# Altium schematic sheet CH573.SchDoc
size A3; SheetNumber: 3; SheetTotal: 3
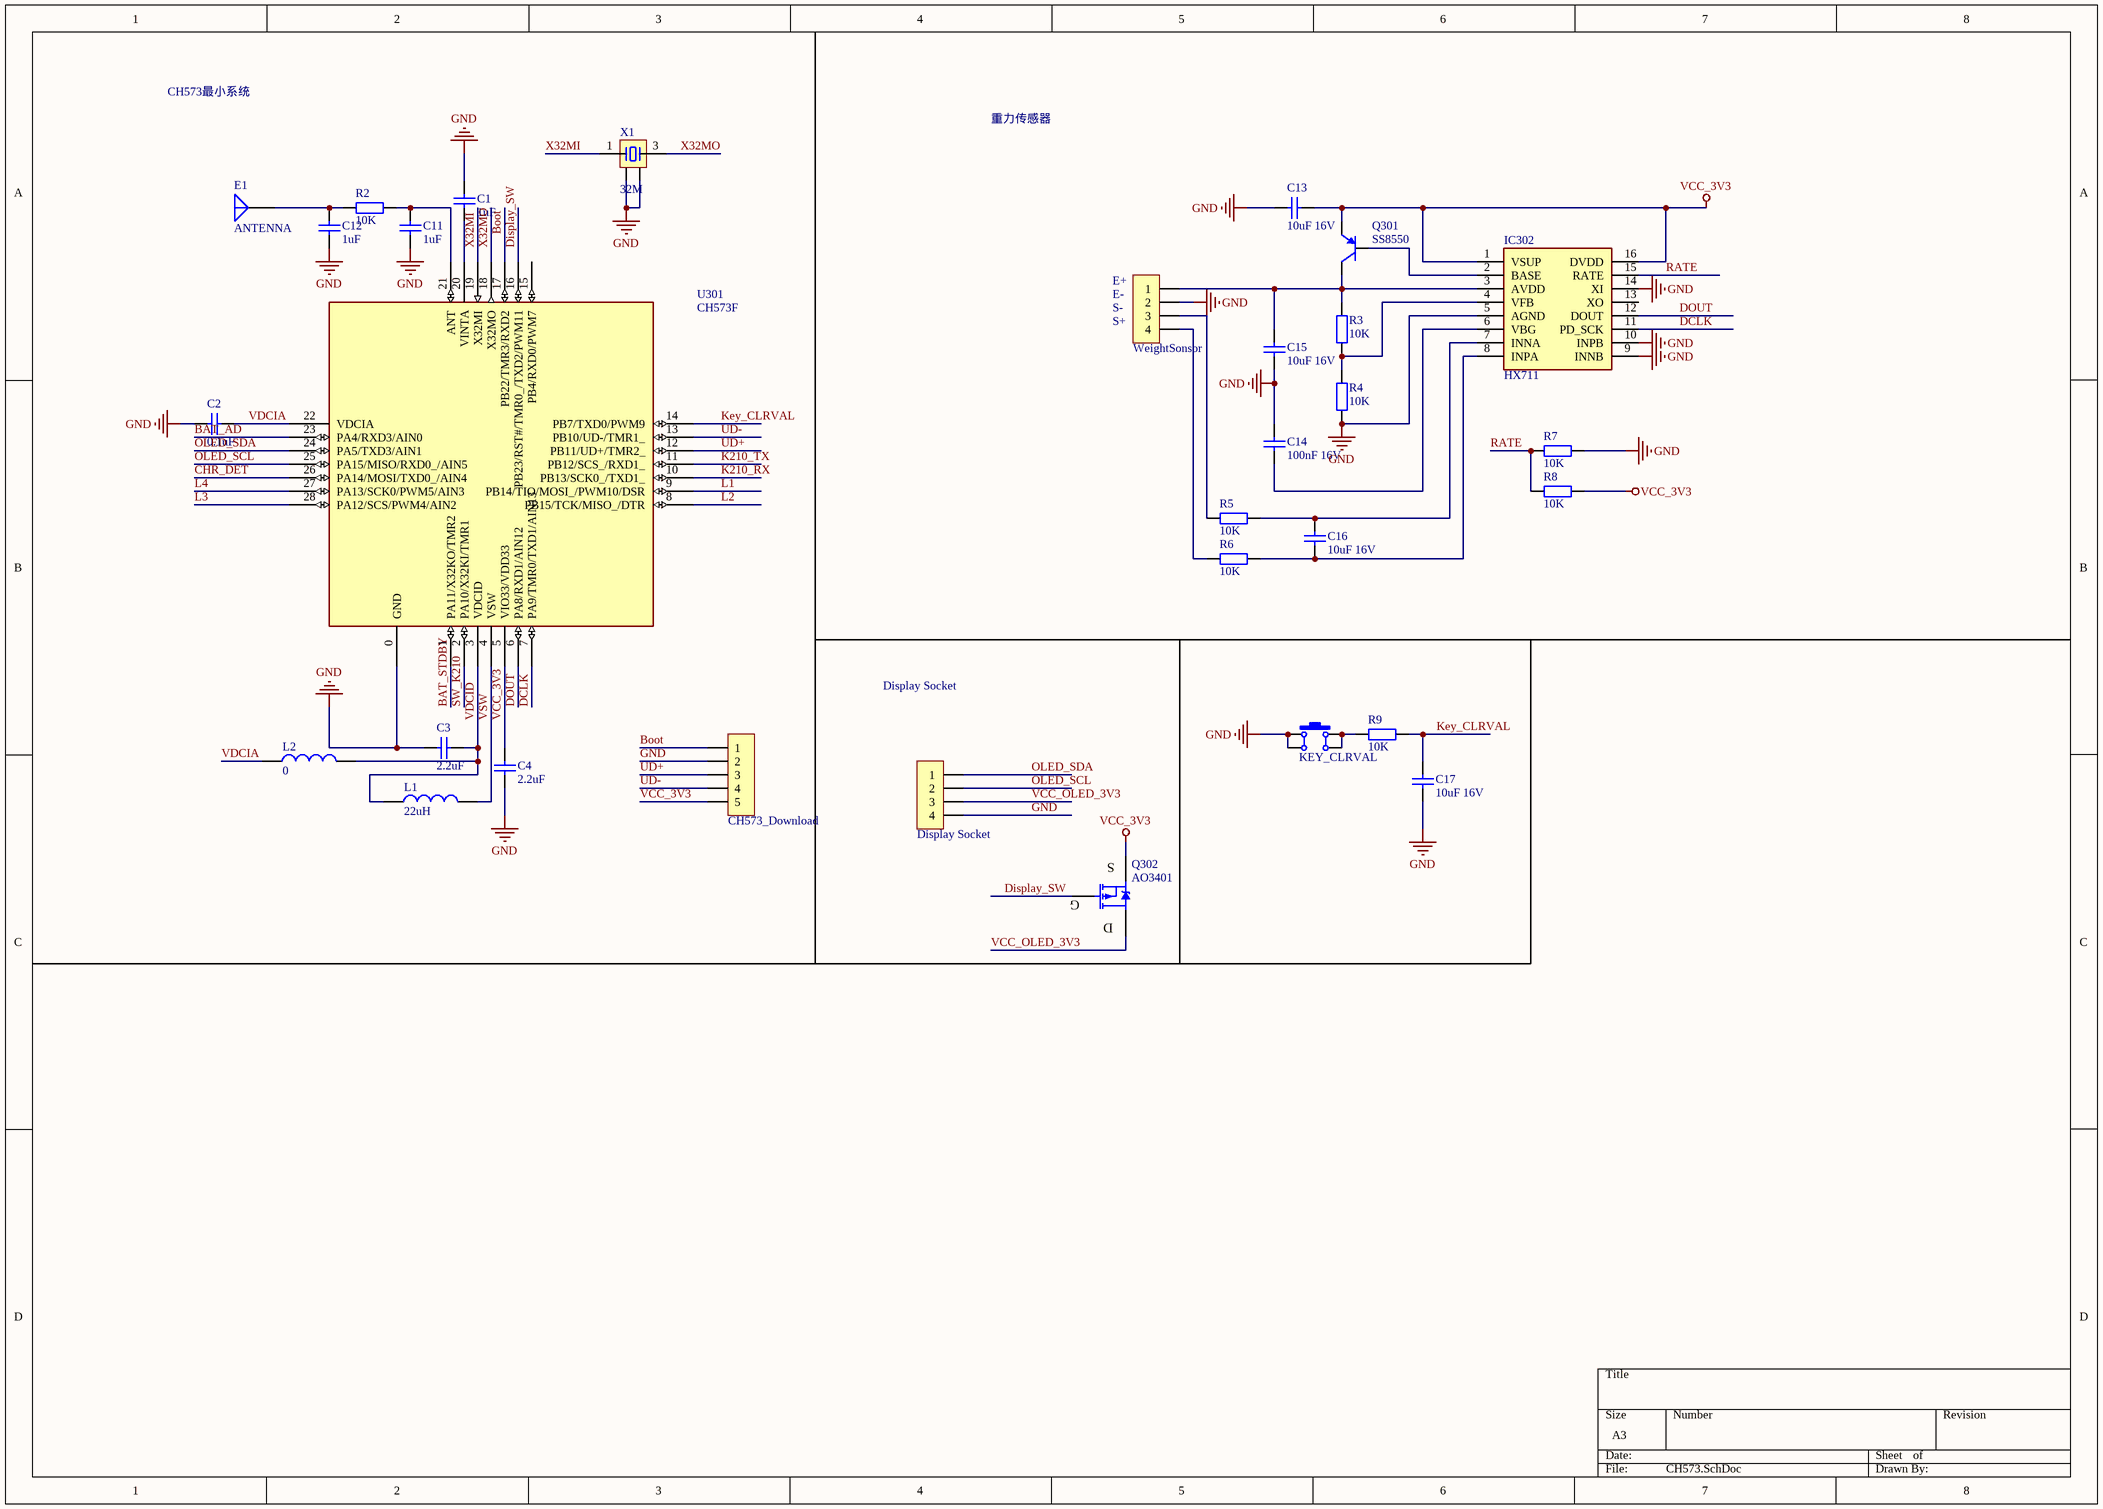
[diagram p0: CH573.SchDoc]

## Parts
C1  1uF  [C0603_L]
C2  0.1uF  [C0603_L]
C3  2.2uF  [C0603_L]
C4  2.2uF  [C0603_L]
C11  1uF  [C0201_L]
C12  1uF  [C0201_L]
C13  10uF 16V  [C0805_L]
C14  100nF 16V  [C0603_L]
C15  10uF 16V  [C0603_L]
C16  10uF 16V  [C0603_L]
C17  10uF 16V  [C0603_L]
CH573_Download  HDR-1X5  [MX1.25-L-5P]  (value not drawn)
Display_Socket  HDR-1X4  [HDR2.54-M-LI-4P]  (value not drawn)
E1  ANTENNA  [ANT-F-1-2.4G-1.6]
IC302  HX711  [SOIC127P600X160-16N]
KEY_CLRVAL  4x4x1.5  [SW SMD-4*4*1.5]  (value not drawn)
L1  22uH  [L0603]
L2  0  [L0603]
Q301  SS8550  [SOT23-3N]
Q302  AO3401  [SOT23-3N]
R2  10K  [R0201_L]
R3  10K  [R0603_L]
R4  10K  [R0603_L]
R5  10K  [R0603_L]
R6  10K  [R0603_L]
R7  10K  [R0603_L]
R8  10K  [R0603_L]
R9  10K  [R0603_L]
U301  CH573F  [QFN28_4X4]
WeightSonsor  HDR-1X4  [XH2.54-LI-4P]  (value not drawn)
X1  32M  [XTAL-3225-4P]

## Nets
GND: C1.2 C2.2 C3.2 C4.2 C11.2 C12.2 C13.1 C14.2 C15.1 C17.1 CH573_Download.2 Display_Socket.4 IC302.5(AGND) IC302.9(INNB) IC302.10(INPB) IC302.14(XI) KEY_CLRVAL.1 KEY_CLRVAL.4 R4.1 R7.1 U301.0(GND) WeightSonsor.2 X1.2 X1.4
VCC_3V3: C4.1 C13.2 CH573_Download.5 IC302.1(VSUP) IC302.16(DVDD) Q301.2(E) Q302.2(S) R8.1 U301.5(VIO33/VDD33)
BAT_AD: U301.23(PA4/RXD3/AIN0)
BAT_STDBY: U301.1(PA11/X32KO/TMR2)
Boot: CH573_Download.1 U301.17(PB22/TMR3/RXD2)
CHR_DET: U301.26(PA14/MOSI/TXD0_/AIN4)
DCLK: IC302.11(PD_SCK) U301.7(PA9/TMR0/TXD1/AIN13)
Display_SW: Q302.1(G) U301.16(PB23/RST#/TMR0_/TXD2/PWM11)
DOUT: IC302.12(DOUT) U301.6(PA8/RXD1/AIN12)
K210_RX: U301.10(PB13/SCK0_/TXD1_)
K210_TX: U301.11(PB12/SCS_/RXD1_)
Key_CLRVAL: C17.2 R9.1 U301.14(PB7/TXD0/PWM9)
L1: U301.9(PB14/TIO/MOSI_/PWM10/DSR)
L2: U301.8(PB15/TCK/MISO_/DTR)
L3: U301.28(PA12/SCS/PWM4/AIN2)
L4: U301.27(PA13/SCK0/PWM5/AIN3)
OLED_SCL: Display_Socket.2 U301.25(PA15/MISO/RXD0_/AIN5)
OLED_SDA: Display_Socket.1 U301.24(PA5/TXD3/AIN1)
RATE: IC302.15(RATE) R7.2 R8.2
SW_K210: U301.2(PA10/X32KI/TMR1)
UD+: CH573_Download.3 U301.12(PB11/UD+/TMR2_)
UD-: CH573_Download.4 U301.13(PB10/UD-/TMR1_)
VCC_OLED_3V3: Display_Socket.3 Q302.3(D)
VDCIA: C2.1 L2.1 U301.22(VDCIA)
VDCID: C3.1 L1.1 L2.2 U301.3(VDCID)
VSW: L1.2 U301.4(VSW)
X32MI: U301.19(X32MI) X1.1
X32MO: U301.18(X32MO) X1.3
NetC1_1: C1.1 U301.20(VINTA)
NetC11_1: C11.1 R2.2 U301.21(ANT)
NetC12_1: C12.1 E1.1(A) R2.1
NetC14_1: C14.1 IC302.6(VBG)
NetC15_2: C15.2 IC302.3(AVDD) Q301.3(C) R3.2 WeightSonsor.1
NetC16_1: C16.1 IC302.8(INPA) R6.1
NetC16_2: C16.2 IC302.7(INNA) R5.1
NetIC302_2: IC302.2(BASE) Q301.1(B)
NetIC302_4: IC302.4(VFB) R3.1 R4.2
NetKEY_CLRVAL_2: KEY_CLRVAL.2 KEY_CLRVAL.3 R9.2
NetR5_2: R5.2 WeightSonsor.3
NetR6_2: R6.2 WeightSonsor.4

Not connected (* = marked no-connect by the designer): IC302 13(XO); U301 15(PB4/RXD0/PWM7)

## Notes on the sheet
- CH573最小系统
- 重力传感器
- (near WeightSonsor) E+
- (near WeightSonsor) E-
- (near WeightSonsor) S-
- (near WeightSonsor) S+
- Display Socket

## Library data of the parts
C1-C4 C11-C17 = C: 贴片电容/MLCC电容; BOM名称: 无极性贴片电容; 联系卖家，免费查找封装: 唯一出售店铺网址https://shop463601444.taobao.com
CH573_Download = Header 5: 5P连接器; 联系卖家 免费技术支持: 封装库来自淘宝卖家ID：黄晶宝石; BOM名称: 5P连接器
Display_Socket WeightSonsor = Header 4: 4P接插件; 联系卖家，免费查找封装: 唯一出售店铺网址https://shop463601444.taobao.com; 封装库来自淘宝卖家ID：黄晶宝石: 其他店铺购入均为盗版封装库，请立即申请退款，本店现金奖励50~200元; BOM名称: 4P接插件
E1 = ANTENNA: Generic Antenna
IC302 = HX711: Integrated Circuit; Manufacturer_Name: AVIA Semiconductor; Datasheet Link: https://cdn.sparkfun.com/datasheets/Sensors/ForceFlex/hx711_english.pdf; Height: 1.6mm; Manufacturer_Part_Number: HX711
KEY_CLRVAL = SW SMD-4x4: 贴片4x4轻触开关; 联系卖家，免费查找封装: 唯一出售店铺网址https://shop463601444.taobao.com; 封装库来自淘宝卖家ID：黄晶宝石: 其他店铺购入的，请立即申请退款，本店现金奖励20~500元; BOM名称: 贴片4x4轻触开关
L1 L2 = L: 贴片小功率电感; BOM名称: 小功率贴片电感; 联系卖家，免费查找封装: 唯一出售店铺网址https://shop463601444.taobao.com
Q301 = 8550-SMD: 高频放大-PNP型; 参数: 40V 1.5A 1W 100MHZ; 8元以下特价购入的买家: 还可以联系卖家远程指导AD软件使用; BOM名称: 高频放大-PNP型
Q302 = AO3401: P沟道 30V/4.2A; BOM名称: 场效应管; 8元以下特价购入的买家: 还可以联系卖家远程指导AD软件使用; 参数: P沟道 30V/4.2A
R2-R9 = R: 贴片电阻; 联系卖家，免费查找封装: 唯一出售店铺网址https://shop463601444.taobao.com; BOM名称: 贴片电阻
U301 = CH573F: RISC-V MCU with BLE/USB/ADC/SPI/4*UART
X1 = XTAL-4P: 4脚无源晶振(谐振器）; 联系卖家，免费查找封装: 唯一出售店铺网址https://shop463601444.taobao.com; BOM名称: 4脚无源晶振(谐振器）